# EAGLE design atmega16u2custom2 (EAGLE 7.1.0)
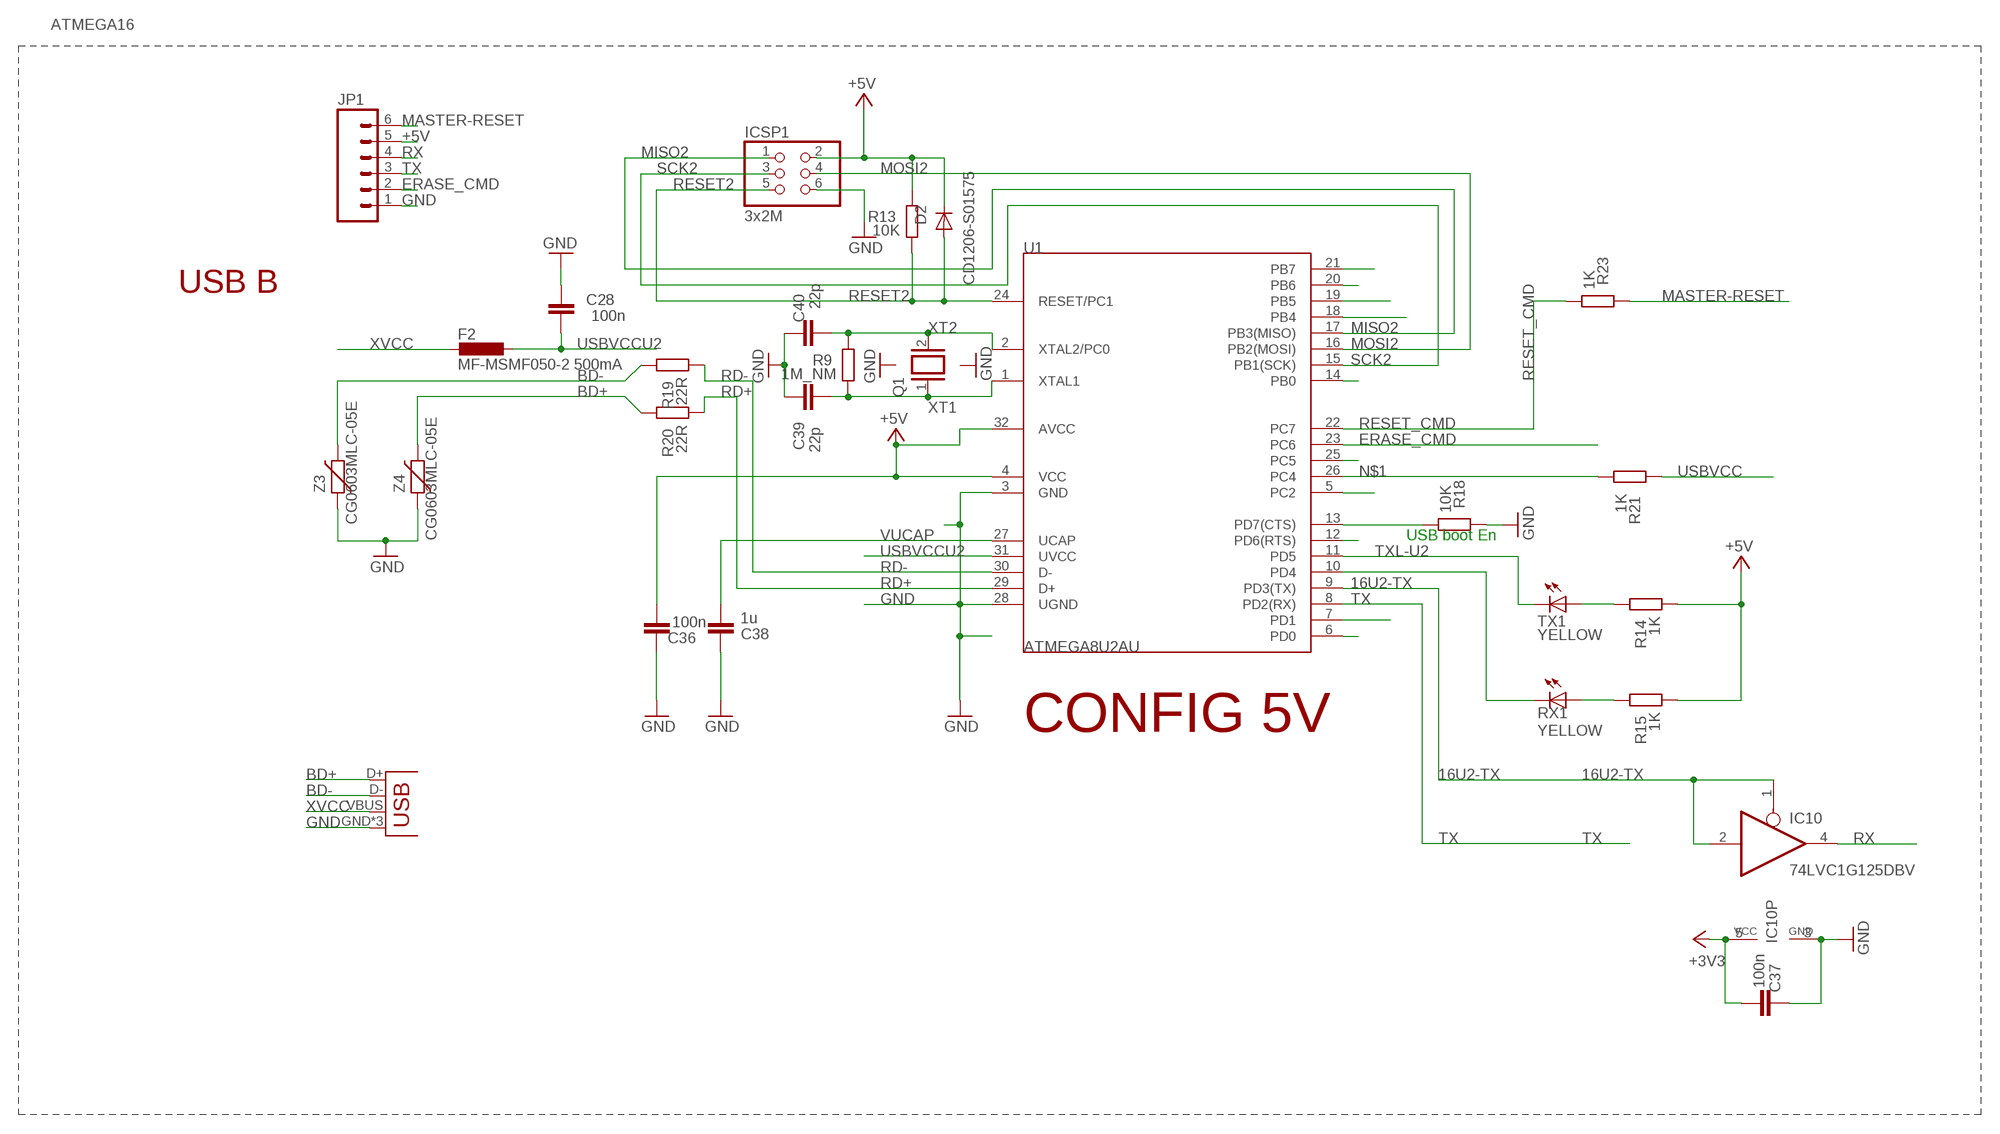
[diagram p0: schematic, sheet 1]

## Parts
C28  100n  C-EUC0805  [C0805]
C36  100n  C-EUC0805  [C0805]
C37  100n  C-EUC0805  [C0805]
C38  1u  C-EUC0805  [C0805]
C39  22p  C-EUC0805  [C0805]
C40  22p  C-EUC0805  [C0805]
D2  CD1206-S01575  DIODE-MINIMELF  [MINIMELF]
F2  MF-MSMF050-2 500mA  L-EUL1812  [L1812]
IC10  74LVC1G125DBV  [SOT23-5]
ICSP1  3x2M  PINHD-2X3  [2X03]
JP1  M06NO_SILK  [1X06_NO_SILK]
JP2  USB-MICROB  [USB-MICROB]
Q1  XTAL/S  [QS]
R9  1M_NM  R-EU_R0805  [R0805]
R13  10K  R-EU_R0805  [R0805]
R14  1K  R-EU_R0805  [R0805]
R15  1K  R-EU_R0805  [R0805]
R18  10K  R-EU_R0805  [R0805]
R19  22R  R-EU_R0805  [R0805]
R20  22R  R-EU_R0805  [R0805]
R21  1K  R-EU_R0805  [R0805]
R23  1K  R-EU_R0805  [R0805]
RX1  YELLOW  LEDCHIP-LED0805  [CHIP-LED0805]
TX1  YELLOW  LEDCHIP-LED0805  [CHIP-LED0805]
U1  ATMEGA8U2AU  [TQFP32-08]
Z3  CG0603MLC-05E  VARISTORCN0603  [CT/CN0603]
Z4  CG0603MLC-05E  VARISTORCN0603  [CT/CN0603]

## Nets
8PB4: U1.18(PB4)
8PB5: U1.19(PB5)
8PB6: U1.20(PB6)
16U2-TX: IC10.1(OE) IC10.2(I) U1.9(PD3(TX))
+3V3: C37.1 IC10.5(VCC)
+5V: C36.1 D2.C ICSP1.2 JP1.5 R13.2 R14.1 R15.1 U1.4(VCC) U1.32(AVCC)
BD+ [USB]: JP2.D+ R20.2 Z4.2
BD- [USB]: JP2.D- R19.2 Z3.2
DTR: R18.1 U1.13(PD7(CTS))
ERASE_CMD: JP1.2 U1.23(PC6)
GND: C28.2 C36.2 C37.2 C38.2 C39.2 C40.2 IC10.3(GND) ICSP1.6 JP1.1 JP2.GND JP2.MT1(GND) JP2.MT2(GND) R18.2 U1.3(GND) U1.28(UGND) Z3.1 Z4.1
MASTER-RESET: JP1.6 R23.2
MISO2: ICSP1.1 U1.17(PB3(MISO))
MOSI2: ICSP1.4 U1.16(PB2(MOSI))
N$1: R21.1 U1.26(PC4)
N$2: U1.5(PC2)
N$3: U1.6(PD0)
N$4: R15.2 RX1.A
N$5: U1.7(PD1)
N$6: U1.12(PD6(RTS))
N$7: U1.25(PC5)
N$8: U1.14(PB0)
N$9: U1.21(PB7)
N$14: R14.2 TX1.A
RD+: R20.1 U1.29(D+)
RD-: R19.1 U1.30(D-)
RESET2: D2.A ICSP1.5 R13.1 U1.24(RESET/PC1)
RESET_CMD: R23.1 U1.22(PC7)
RX: IC10.4(O) JP1.4
RXL-U2: RX1.C U1.10(PD4)
SCK2: ICSP1.3 U1.15(PB1(SCK))
TX: JP1.3 U1.8(PD2(RX))
TXL-U2: TX1.C U1.11(PD5)
USBVCC: R21.2
USBVCCU2: C28.1 F2.1 U1.31(UVCC)
VUCAP: C38.1 U1.27(UCAP)
XT1: C39.1 Q1.1 R9.1 U1.1(XTAL1)
XT2: C40.1 Q1.2 R9.2 U1.2(XTAL2/PC0)
XVCC [usbvcc]: F2.2 JP2.VBUS

## Notes on the sheet
- ATMEGA16
- USB B
- USB boot En
- CONFIG 5V

## Library data of the parts
C28 C36-C40 = SmartPrj:C-EU: CAPACITOR, European symbol
D2 = diode:DIODE-: DIODE
F2 = rcl:L-EU: INDUCTOR, European symbol
IC10 = 74xx-little-us:74*1G125: Single Bus Buffer Gate with 3-State Output
ICSP1 = SmartPrj:PINHD-2X3: PIN HEADER
JP1 = SparkFun-Connectors:M06: Header 6 Standard 6-pin 0.1" header. Use with straight break away headers (SKU : PRT-00116), right angle break away headers (PRT-00553), swiss pins (PRT-00743), machine pins (PRT-00117), and female headers (PRT-00115). Molex polarized connector foot print use with SKU : PRT-08094 with associated crimp pins and housings. NOTES ON THE VARIANTS LOCK and LOCK_LONGPADS... This footprint was designed to help hold the alignment of a through-hole component (i.e. 6-pin header) while soldering it into place. You may notice that each hole has been shifted either up or down by 0.005 of an inch from it's more standard position (which is a perfectly straight line). This slight alteration caused the pins (the squares in the middle) to touch the edges of the holes. Because they are alternating, it causes a "brace" to hold the component in place. 0.005 has proven to be the perfect amount of "off-center" position when using our standard breakaway headers. Although looks a little odd when you look at the bare footprint, once you have a header in there, the alteration is very hard to notice. Also,if you push a header all the way into place, it is covered up entirely on the bottom side. This idea of altering the position of holes to aid alignment will be further integrated into the Sparkfun Library for other footprints. It can help hold any component with 3 or more connection pins.
JP2 = SparkFun-Connectors:USB: USB Connectors USB-B-PTH is fully proven SKU : PRT-00139/CONN-08278 USB-miniB is fully proven SKU : PRT-00587 USB-A-PCB is untested. USB-A-H is throughly reviewed, but untested. Spark Fun Electronics SKU : PRT-00437 USB-B-SMT is throughly reviewed, but untested. Needs silkscreen touching up. USB-A-S has not been used/tested USB-MB-H has not been used/tested USB-MICROB has been used. CONN-09505; PROD_ID: CONN-09505
Q1 = special:XTAL/S: CRYSTAL
R9 R13-R15 R18-R21 R23 = SmartPrj:R-EU_: RESISTOR, European symbol
RX1 TX1 = led:LED: LED OSRAM: - CHIPLED LG R971, LG N971, LY N971, LG Q971, LY Q971, LO R971, LY R971 LH N974, LH R974 LS Q976, LO Q976, LY Q976 LO Q996 - Hyper CHIPLED LW Q18S LB Q993, LB Q99A, LB R99A - SideLED LS A670, LO A670, LY A670, LG A670, LP A670 LB A673, LV A673, LT A673, LW A673 LH A674 LY A675 LS A676, LA A676, LO A676, LY A676, LW A676 LS A679, LY A679, LG A679 - Hyper Micro SIDELED® LS Y876, LA Y876, LO Y876, LY Y876 LT Y87S - SmartLED LW L88C, LW L88S LB L89C, LB L89S, LG L890 LS L89K, LO L89K, LY L89K LS L896, LA L896, LO L896, LY L896 - TOPLED LS T670, LO T670, LY T670, LG T670, LP T670 LSG T670, LSP T670, LSY T670, LOP T670, LYG T670 LG T671, LOG T671, LSG T671 LB T673, LV T673, LT T673, LW T673 LH T674 LS T676, LA T676, LO T676, LY T676, LB T676, LH T676, LSB T676, LW T676 LB T67C, LV T67C, LT T67C, LS T67K, LO T67K, LY T67K, LW E67C LS E67B, LA E67B, LO E67B, LY E67B, LB E67C, LV E67C, LT E67C LW T67C LS T679, LY T679, LG T679 LS T770, LO T770, LY T770, LG T770, LP T770 LB T773, LV T773, LT T773, LW T773 LH T774 LS E675, LA E675, LY E675, LS T675 LS T776, LA T776, LO T776, LY T776, LB T776 LHGB T686 LT T68C, LB T68C - Hyper Mini TOPLED® LB M676 - Mini TOPLED Santana® LG M470 LS M47K, LO M47K, LY M47K Source: http://www.osram.convergy.de LUXEON: - LUMILED® LXK2-PW12-R00, LXK2-PW12-S00, LXK2-PW14-U00, LXK2-PW14-V00 LXK2-PM12-R00, LXK2-PM12-S00, LXK2-PM14-U00 LXK2-PE12-Q00, LXK2-PE12-R00, LXK2-PE12-S00, LXK2-PE14-T00, LXK2-PE14-U00 LXK2-PB12-K00, LXK2-PB12-L00, LXK2-PB12-M00, LXK2-PB14-N00, LXK2-PB14-P00, LXK2-PB14-Q00 LXK2-PR12-L00, LXK2-PR12-M00, LXK2-PR14-Q00, LXK2-PR14-R00 LXK2-PD12-Q00, LXK2-PD12-R00, LXK2-PD12-S00 LXK2-PH12-R00, LXK2-PH12-S00 LXK2-PL12-P00, LXK2-PL12-Q00, LXK2-PL12-R00 Source: www.luxeon.com KINGBRIGHT: KA-3528ASYC Source: www.kingbright.com
U1 = SparkFun-DigitalIC:ATMEGA8U2: Atmel 32-pin 8-bit Microcontroller with 8/16/32K Bystes of ISP Flash and USB Controller. ATmega8U2, ATmega16U2, and ATmega32U2
Z3 Z4 = varistor:VARISTOR: VARISTOR

## Net classes
0 default: width 0.203 mm, drill 0.406 mm, clearance 0.203 mm
1 USB: width 0.203 mm, drill 0.406 mm, clearance 0.203 mm
3 usbvcc: width 0.203 mm, drill 0.406 mm, clearance 0.203 mm

## Board
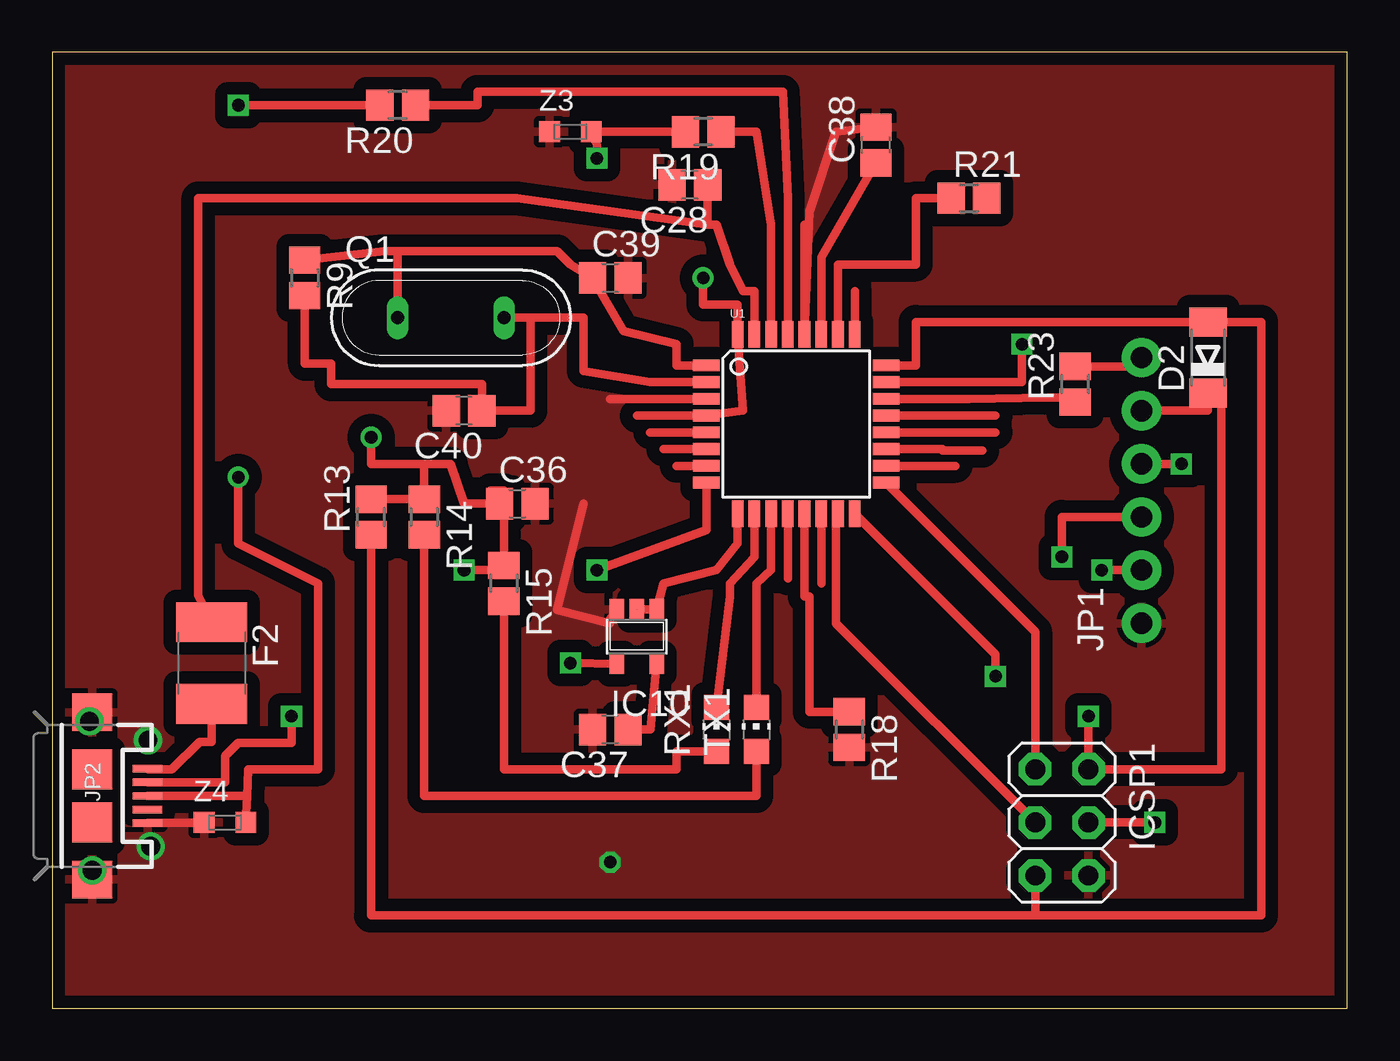
[diagram p1: board, top side]
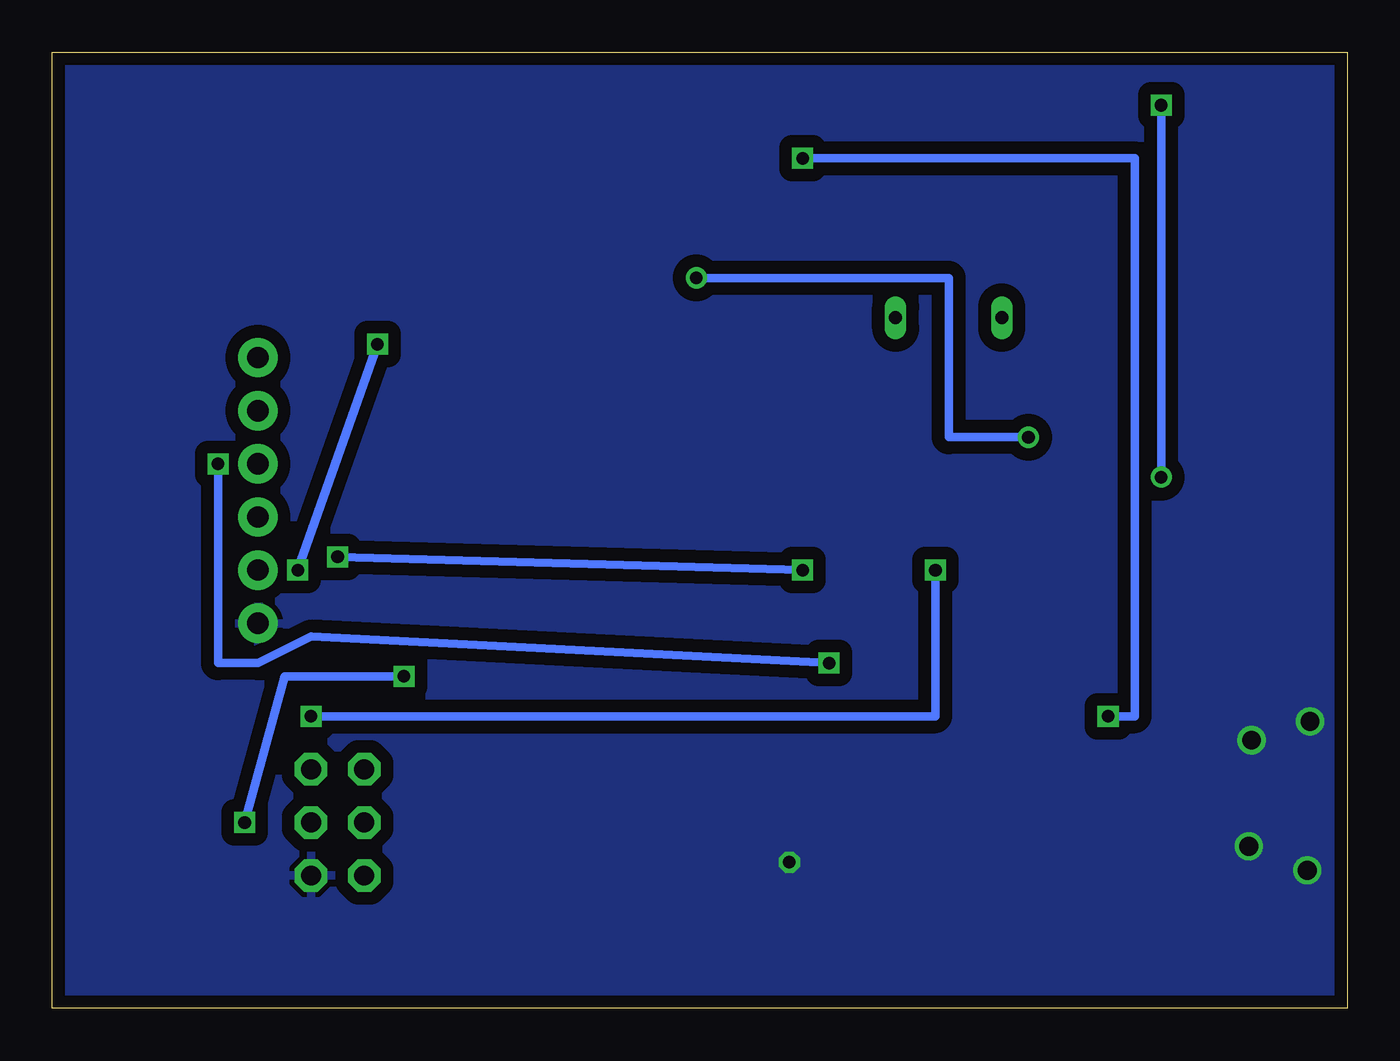
[diagram p2: board, bottom side, seen from below]

Size 61.9 x 45.71 mm. Coordinates in mm from the lower left corner, seen from the top.
Outline: 0,0 61.9,0 61.9,45.71 0,45.71 0,0
Copper layers (1*16): Top 0.0178mm / dielectric 59mil / Bottom 0.0178mm
Design rules "epl-lpkf": minimum track width 8mil, minimum drill 0.35mm, track to track 8mil, track to pad 8mil, pad to pad 8mil, via to via 8mil, smd to smd 8mil, copper to edge 15mil, drill to drill 15mil, minimum pad ring 8mil, minimum via ring 8mil, stop-mask expansion 3mil, vias tented up to drill 0mil, thermal gap 10mil

### Footprints (pad centres in the part's own frame; a part is rotated, then mirrored left to right if it is on the bottom)
C0805 = smd 1.3 x 1.5: 1 -0.85,0; 2 0.85,0
MINIMELF = smd 1.4 x 1.8: A 1.7,0; C -1.7,0
L1812 = smd 1.9 x 3.4: 1 -1.95,0; 2 1.95,0
SOT23-5 = smd 0.69 x 0.99: 1 -0.95,-1.29; 2 0,-1.29; 3 0.95,-1.29; 4 0.95,1.3; 5 -0.95,1.3
2X03 = drill 0.95 pad 1.55 octagon: 1 -2.54,-1.27; 2 -2.54,1.27; 3 0,-1.27; 4 0,1.27; 5 2.54,-1.27; 6 2.54,1.27
1X06_NO_SILK = drill 1.016 pad 1.88: 1 0,0; 2 2.54,0; 3 5.08,0; 4 7.62,0; 5 10.16,0; 6 12.7,0
USB-MICROB = smd 0.35 x 1.4: D+ 0,2.65; D- -0.65,2.65; GND 1.3,2.65; ID 0.65,2.65; VBUS -1.3,2.65 | smd 1.8 x 1.9: MT1 -4,0; MT2 4,0 | smd 1.9 x 1.9: P$1 -1.27,0; P$2 1.27,0
QS = drill 0.61 long: 1 -2.54,0; 2 2.54,0
R0805 = smd 1.3 x 1.5: 1 -0.85,0; 2 0.85,0
CHIP-LED0805 = smd 1.2 x 1.2: A 0,-1.05; C 0,1.05
TQFP32-08 = smd 1.27 x 0.559: 1 -4.293,2.8; 2 -4.293,2; 3 -4.293,1.2; 4 -4.293,0.4; 5 -4.293,-0.4; 6 -4.293,-1.2; 7 -4.293,-2; 8 -4.293,-2.8; 17 4.293,-2.8; 18 4.293,-2; 19 4.293,-1.2; 20 4.293,-0.4; 21 4.293,0.4; 22 4.293,1.2; 23 4.293,2; 24 4.293,2.8 | smd 0.559 x 1.27: 9 -2.8,-4.293; 10 -2,-4.293; 11 -1.2,-4.293; 12 -0.4,-4.293; 13 0.4,-4.293; 14 1.2,-4.293; 15 2,-4.293; 16 2.8,-4.293; 25 2.8,4.293; 26 2,4.293; 27 1.2,4.293; 28 0.4,4.293; 29 -0.4,4.293; 30 -1.2,4.293; 31 -2,4.293; 32 -2.8,4.293
CT/CN0603 = smd 1 x 1: 1 -1,0; 2 1,0

### Placement (x,y rotation side)
C28  30.48,39.37 180 top
C36  22.23,24.13 0 top
C37  26.67,13.34 180 top
C38  39.37,41.27 90 top
C39  26.67,34.92 0 top
C40  19.68,28.57 180 top
D2  55.24,31.11 90 top
F2  7.62,16.51 270 top
IC10  27.94,17.78 180 top
ICSP1  48.26,8.89 270 top
JP1  52.07,18.41 90 top
JP2  1.91,10.16 270 top
Q1  19.05,33.02 0 top
R9  12.06,34.92 270 top
R13  15.24,23.5 90 top
R14  17.78,23.5 270 top
R15  21.59,20.32 270 top
R18  38.1,13.34 270 top
R19  31.11,41.91 180 top
R20  16.51,43.18 180 top
R21  43.81,38.73 0 top
R23  48.9,29.84 90 top
RX1  31.75,13.34 0 top
TX1  33.66,13.34 0 top
U1  35.56,27.94 0 top
Z3  24.77,41.91 0 top
Z4  8.26,8.89 0 top

### Tracks (layer width: path | path; a pad name or v marks a point on that pad's centre or on a via)
8PB4
  Top 0.406: U1.18 43.18,25.94
8PB5
  Top 0.406: U1.19 42.55,26.74 42.55,26.67 44.45,26.67
8PB6
  Top 0.406: U1.20 45.09,27.54
16U2-TX
  Top 0.406: U1.9 32.76,22.23 31.75,20.95 29.23,20.32 IC10.1 IC10.2
+3V3
  Top 0.406: C37.1 28.59,13.34 IC10.5
+5V  (via drill 0.6)
  Top 0.406: 21.59,24.13 R15.1 21.59,20.95 v19.68,20.95 | 21.59,24.13 C36.1 20.95,24.13 | v49.53,13.97 ICSP1.2 55.88,11.43 55.88,29.41 D2.C 55.24,28.57 JP1.5 | R13.2 R14.1 17.78,26.04 | 21.59,24.13 21.59,24.77 20.95,24.77 20.95,24.13 | 27.94,28.34 U1.4 33.02,28.57 U1.32 32.76,33.66 31.11,33.66 v31.11,34.92 | 20.95,24.13 19.68,24.13 19.05,26.04 17.78,26.04 | 17.78,26.04 15.24,26.04 v15.24,27.3
  Bottom 0.406: v49.53,13.97 19.68,13.97 v19.68,20.95 | v15.24,27.3 19.05,27.3 19.05,34.92 v31.11,34.92
BD+  (via drill 0.6)
  Top 0.406: 9.3,10.14 9.36,11.43 12.7,11.43 12.7,20.32 8.89,22.23 v8.89,25.4 | 9.3,10.14 Z4.2 | v8.89,43.18 R20.2 | JP2.D+ 9.3,10.16 9.3,10.14
  Bottom 0.406: v8.89,25.4 v8.89,43.18
BD-  (via drill 0.6)
  Top 0.406: R19.2 Z3.2 26.04,41.27 v26.04,40.64 | v11.43,13.97 11.43,12.7 8.89,12.7 8.26,12.06 8.26,10.81 JP2.D-
  Bottom 0.406: v26.04,40.64 10.16,40.64 10.16,13.97 v11.43,13.97
DTR
  Top 0.406: U1.13 35.96,19.68 36.2,19.68 36.2,14.19 R18.1
ERASE_CMD  (via drill 0.6)
  Top 0.406: JP1.2 v50.16,20.95 | U1.23 46.35,29.94 v46.35,31.75
  Bottom 0.406: v50.16,20.95 v46.35,31.75
GND  (via drill 0.6, 0.9)
  Top 0.406: U1.3 26.67,29.14 | 35.96,37.47 U1.28 36.2,38.1 37.47,41.91 C38.2 | IC10.3 26.67,18.63 26.67,18.41 24.13,19.05 25.4,24.13 | JP2.GND 7.25,8.86 Z4.1
  other vias: 26.67,6.99 1.78,13.72 1.91,6.6 4.7,7.75 4.57,12.83
  pour Top (isolate 0.61): 0,0 61.59,0 61.59,45.72 0,45.72
  pour Bottom (isolate 0.61): 0,0 61.59,0 61.59,45.72 0,45.72
MASTER-RESET
  Top 0.406: R23.2 52.07,30.7 JP1.6
MISO2
  Top 0.406: U1.17 46.99,18 ICSP1.1
MOSI2  (via drill 0.6)
  Top 0.406: v52.7,8.89 ICSP1.4 | U1.16 45.09,16.92 v45.09,15.88
  Bottom 0.406: v45.09,15.88 50.8,15.88 v52.7,8.89
N$1
  Top 0.406: U1.26 37.56,35.56 41.27,35.56 41.27,38.73 R21.1
N$2
  Top 0.406: U1.5 28.57,27.54
N$3
  Top 0.406: U1.6 29.21,26.74
N$4
  Top 0.406: R15.2 21.59,11.43 29.84,11.43 29.84,12.29 RX1.A
N$5
  Top 0.406: U1.7 29.84,25.94
N$6
  Top 0.406: U1.12 35.16,20.55
N$7
  Top 0.406: U1.25 38.36,34.29
N$8
  Top 0.406: U1.14 36.76,20.32
N$9
  Top 0.406: U1.21 45.09,28.34
N$14
  Top 0.406: R14.2 17.78,10.16 33.66,10.16 TX1.A
RD+
  Top 0.406: U1.29 35.16,38.73 34.92,43.81 20.32,43.81 20.32,43.18 R20.1
RD-
  Top 0.406: U1.30 34.36,37.47 33.66,41.91 R19.1
RESET2
  Top 0.406: U1.24 41.27,30.74 41.27,32.81 D2.A 57.78,32.81 57.78,4.45 46.99,4.45 | ICSP1.5 46.99,4.45 | R13.1 15.24,4.45 46.99,4.45
RESET_CMD
  Top 0.406: U1.22 43.81,29.14 47.62,29.21 48.9,29.21 R23.1
RX  (via drill 0.6)
  Top 0.406: IC10.4 v24.77,16.51 | v53.98,26.04 JP1.4
  Bottom 0.406: v24.77,16.51 49.53,17.78 52.07,16.51 53.98,16.51 v53.98,26.04
RXL-U2
  Top 0.406: U1.10 33.56,21.59 32.38,20.32 32.38,19.68 RX1.C
SCK2
  Top 0.406: U1.15 37.47,23.55 37.47,18.41 ICSP1.3
TX  (via drill 0.6)
  Top 0.406: U1.8 31.27,22.86 v26.04,20.95 | v48.26,21.59 48.26,23.5 JP1.3
  Bottom 0.406: v26.04,20.95 v48.26,21.59
TXL-U2
  Top 0.406: U1.11 34.36,20.95 33.66,20.32 TX1.C
USBVCCU2
  Top 0.406: U1.31 33.56,34.29 33.02,34.29 32.38,35.56 31.75,37.47 31.33,37.47 | F2.1 6.99,19.73 6.99,38.73 22.23,38.73 31.33,37.47 | 31.33,37.47 C28.1
VUCAP
  Top 0.406: U1.27 36.76,35.91 C38.1
XT1
  Top 0.406: U1.1 29.84,30.74 29.84,31.75 27.3,32.38 C39.1 24.77,35.56 24.13,36.2 16.51,36.2 | 16.51,36.2 15.88,36.2 R9.1 | Q1.1 16.51,36.2
XT2
  Top 0.406: U1.2 28.57,29.94 25.4,30.48 25.4,33.02 22.86,33.02 | R9.2 12.06,30.82 13.34,30.82 13.34,29.84 20.54,29.84 C40.1 22.86,28.57 22.86,33.02 | Q1.2 22.86,33.02
XVCC
  Top 0.406: F2.2 7.62,12.75 7.04,12.75 5.71,11.43 4.58,11.43 JP2.VBUS